# Altium project PCB_Project.PrjPcb
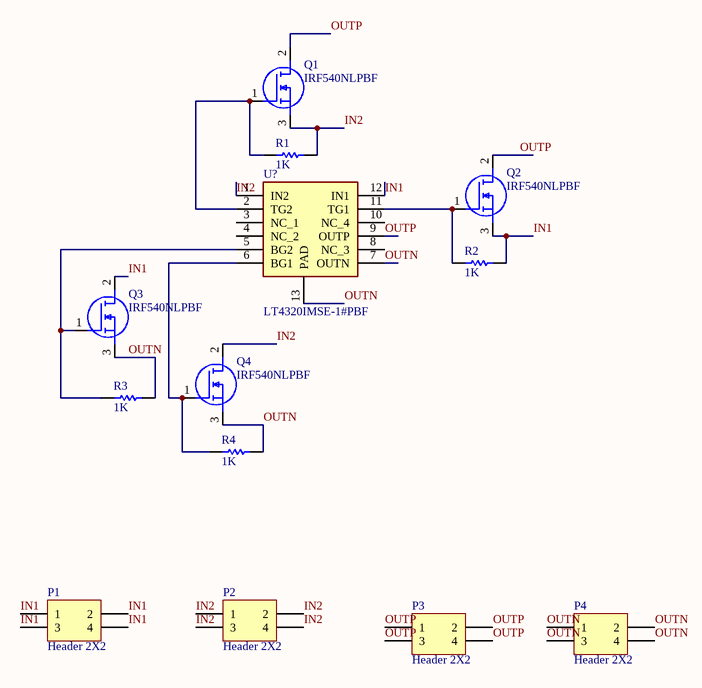
[diagram p0: LT4320.SchDoc]
1 sheet, 13 parts. Net scope: global (net labels, ports and power ports of the same name join across sheets).
Board file: LT4320.PcbDoc

## Sheet LT4320.SchDoc
size A4

### Parts
P1  Header 2X2  [HDR2X2]
P2  Header 2X2  [HDR2X2]
P3  Header 2X2  [HDR2X2]
P4  Header 2X2  [HDR2X2]
Q1  IRF540NLPBF  [TO254P483X1016X1501-3P]
Q2  IRF540NLPBF  [TO254P483X1016X1501-3P]
Q3  IRF540NLPBF  [TO254P483X1016X1501-3P]
Q4  IRF540NLPBF  [TO254P483X1016X1501-3P]
R1  value 1K  [0805R]  (hidden comment: Res)
R2  value 1K  [0805R]  (hidden comment: Res)
R3  value 1K  [0805R]  (hidden comment: Res)
R4  value 1K  [0805R]  (hidden comment: Res)
U?  LT4320IMSE-1#PBF  [SOP65P490X110-12N]

### Nets
IN1: P1.1 P1.2 P1.3 P1.4 Q2.3(S) Q3.2(D) R2.2 U?.12(IN1)
IN2: P2.1 P2.2 P2.3 P2.4 Q1.3(S) Q4.2(D) R1.2 U?.1(IN2)
OUTN: P4.1 P4.2 P4.3 P4.4 Q3.3(S) Q4.3(S) R3.2 R4.2 U?.7(OUTN) U?.13(PAD)
OUTP: P3.1 P3.2 P3.3 P3.4 Q1.2(D) Q2.2(D) U?.9(OUTP)
NetQ1_1: Q1.1(G) R1.1 U?.2(TG2)
NetQ2_1: Q2.1(G) R2.1 U?.11(TG1)
NetQ3_1: Q3.1(G) R3.1 U?.5(BG2)
NetQ4_1: Q4.1(G) R4.1 U?.6(BG1)

Not connected (* = marked no-connect by the designer): U? 3(NC_1) 4(NC_2) 8(NC_3) 10(NC_4)

### Library data of the parts
P1-P4 = Header 2X2: Header, 2-Pin, Dual row; LatestRevisionDate: 17-Jul-2002; LatestRevisionNote: Re-released for DXP Platform.; Publisher: Altium Limited
Q1-Q4 = IRF540NLPBF: MOSFET (N-Channel); Manufacturer_Name: International Rectifier; Datasheet Link: https://www.infineon.com/dgdl/irf540nspbf.pdf?fileId=5546d462533600a4015355e3a72819a3; Height: 4.83mm; Manufacturer_Part_Number: IRF540NLPBF; Mouser Part Number: 942-IRF540NLPBF; Mouser Price/Stock: http://www.mouser.com/Search/ProductDetail.aspx?qs=9%252bKlkBgLFf0FQw5bWQHS0A%3d%3d
R1-R4 = Res: Resistor; Published: 8-Jun-2000; LatestRevisionDate: 17-Jul-2002; LatestRevisionNote: Re-released for DXP Platform.; PackageReference: AXIAL-0.3; Publisher: Altium Limited; PackageDescription: Axial Device, Thru-Hole; 2 Leads; 0.3 in Pin Spacing
U? = LT4320IMSE-1#PBF: Undefined or Miscellaneous; Manufacturer_Name: Linear Technology; Datasheet Link: http://www.linear.com/docs/43273; Height: 1.1mm; Manufacturer_Part_Number: LT4320IMSE-1#PBF; Mouser Part Number: 584-LT4320IMSE-1#PBF